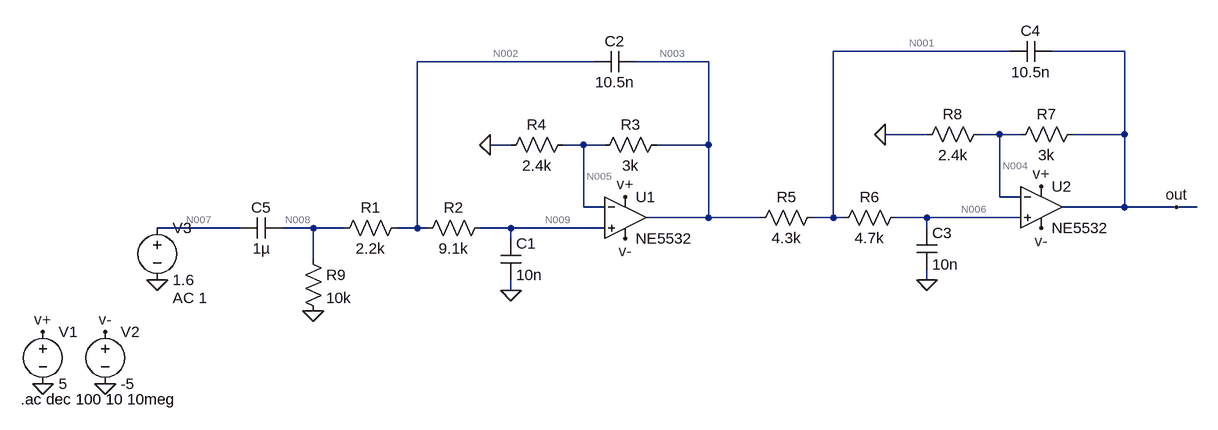
[diagram p0: schematic AF amp.asc]
AF amp.asc, the LTspice schematic file:
Version 4
SHEET 1 1012 680
WIRE 720 -128 448 -128
WIRE 896 -128 784 -128
WIRE 80 -112 -192 -112
WIRE 256 -112 144 -112
WIRE 592 0 528 0
WIRE 704 0 672 0
WIRE 736 0 704 0
WIRE 896 0 896 -128
WIRE 896 0 816 0
WIRE -48 16 -80 16
WIRE 64 16 32 16
WIRE 96 16 64 16
WIRE 256 16 256 -112
WIRE 256 16 176 16
WIRE 704 96 704 0
WIRE 736 96 704 96
WIRE 64 112 64 16
WIRE 96 112 64 112
WIRE 896 112 896 0
WIRE 896 112 800 112
WIRE 976 112 896 112
WIRE 1008 112 976 112
WIRE 256 128 256 16
WIRE 256 128 160 128
WIRE 336 128 256 128
WIRE 448 128 448 -128
WIRE 448 128 416 128
WIRE 464 128 448 128
WIRE 592 128 544 128
WIRE 736 128 592 128
WIRE -464 144 -592 144
WIRE -352 144 -400 144
WIRE -304 144 -352 144
WIRE -192 144 -192 -112
WIRE -192 144 -224 144
WIRE -176 144 -192 144
WIRE -48 144 -96 144
WIRE 96 144 -48 144
WIRE 592 144 592 128
WIRE -48 160 -48 144
WIRE -352 192 -352 144
WIRE 592 224 592 208
WIRE -48 240 -48 224
FLAG -768 304 v+
FLAG 128 96 v+
FLAG -672 304 v-
FLAG 128 160 v-
FLAG -672 384 0
FLAG -768 384 0
FLAG -592 224 0
FLAG -48 240 0
FLAG -80 16 0
FLAG 768 80 v+
FLAG 768 144 v-
FLAG 592 224 0
FLAG 976 112 out
FLAG -352 272 0
FLAG 528 0 0
DATAFLAG 256 -80 ""
DATAFLAG 896 -64 ""
DATAFLAG -384 144 ""
SYMBOL Opamps\\NE5532 128 64 R0
SYMATTR InstName U1
SYMBOL voltage -768 288 R0
WINDOW 123 0 0 Left 0
WINDOW 39 0 0 Left 0
SYMATTR InstName V1
SYMATTR Value 5
SYMBOL voltage -672 288 R0
WINDOW 123 0 0 Left 0
WINDOW 39 0 0 Left 0
SYMATTR InstName V2
SYMATTR Value -5
SYMBOL voltage -592 128 R0
WINDOW 123 24 124 Left 2
WINDOW 39 0 0 Left 0
SYMATTR InstName V3
SYMATTR Value 1.6
SYMATTR Value2 AC 1
SYMBOL res -208 128 R90
WINDOW 0 0 56 VBottom 2
WINDOW 3 32 56 VTop 2
SYMATTR InstName R1
SYMATTR Value 2.2k
SYMBOL res -80 128 R90
WINDOW 0 0 56 VBottom 2
WINDOW 3 32 56 VTop 2
SYMATTR InstName R2
SYMATTR Value 9.1k
SYMBOL cap -64 160 R0
SYMATTR InstName C1
SYMATTR Value 10n
SYMBOL cap 144 -128 R90
WINDOW 0 0 32 VBottom 2
WINDOW 3 32 32 VTop 2
SYMATTR InstName C2
SYMATTR Value 10.5n
SYMBOL res 192 0 R90
WINDOW 0 0 56 VBottom 2
WINDOW 3 32 56 VTop 2
SYMATTR InstName R3
SYMATTR Value 3k
SYMBOL res 48 0 R90
WINDOW 0 0 56 VBottom 2
WINDOW 3 32 56 VTop 2
SYMATTR InstName R4
SYMATTR Value 2.4k
SYMBOL Opamps\\NE5532 768 48 R0
SYMATTR InstName U2
SYMBOL res 432 112 R90
WINDOW 0 0 56 VBottom 2
WINDOW 3 32 56 VTop 2
SYMATTR InstName R5
SYMATTR Value 4.3k
SYMBOL res 560 112 R90
WINDOW 0 0 56 VBottom 2
WINDOW 3 32 56 VTop 2
SYMATTR InstName R6
SYMATTR Value 4.7k
SYMBOL cap 576 144 R0
SYMATTR InstName C3
SYMATTR Value 10n
SYMBOL cap 784 -144 R90
WINDOW 0 0 32 VBottom 2
WINDOW 3 32 32 VTop 2
SYMATTR InstName C4
SYMATTR Value 10.5n
SYMBOL res 832 -16 R90
WINDOW 0 0 56 VBottom 2
WINDOW 3 32 56 VTop 2
SYMATTR InstName R7
SYMATTR Value 3k
SYMBOL res 688 -16 R90
WINDOW 0 0 56 VBottom 2
WINDOW 3 32 56 VTop 2
SYMATTR InstName R8
SYMATTR Value 2.4k
SYMBOL cap -400 128 R90
WINDOW 0 0 32 VBottom 2
WINDOW 3 32 32 VTop 2
SYMATTR InstName C5
SYMATTR Value 1µ
SYMBOL res -368 176 R0
SYMATTR InstName R9
SYMATTR Value 10k
TEXT -802 408 Left 2 !.ac dec 100 10 10meg

The netlist it stands for:
* AF amp.asc
XU1 N009 N005 v+ v- N003 NE5532  ; pins In+ In- V+ V- OUT
V1 v+ 0 5
V2 v- 0 -5
V3 N007 0 1.6 AC 1
R1 N002 N008 2.2k
R2 N009 N002 9.1k
C1 N009 0 10n
C2 N003 N002 10.5n
R3 N003 N005 3k
R4 N005 0 2.4k
XU2 N006 N004 v+ v- out NE5532  ; pins In+ In- V+ V- OUT
R5 N001 N003 4.3k
R6 N006 N001 4.7k
C3 N006 0 10n
C4 out N001 10.5n
R7 out N004 3k
R8 N004 0 2.4k
C5 N008 N007 1µ
R9 N008 0 10k
.ac dec 100 10 10meg
.backanno
.end

* Results of the author's LTspice run, read from the files saved beside the schematic
* Operating Point, zero values left out:
*   V(n003) = -22.37 mV
*   V(v-) = -5 V
*   V(v+) = 5 V
*   V(n005) = -10.61 mV
*   V(n009) = -10.61 mV
*   V(n007) = 1.6 V
*   V(n002) = -6.079 mV
*   V(n008) = -4.983 mV
*   V(out) = -58.9 mV
*   V(n004) = -26.84 mV
*   V(n006) = -26.85 mV
*   V(n001) = -24.51 mV
*   I(R9) = -498.3 nA
*   I(R8) = -11.19 µA
*   I(R7) = -10.69 µA
*   I(R6) = -498.2 nA
*   I(R5) = -498.2 nA
*   I(R4) = -4.419 µA
*   I(R3) = -3.921 µA
*   I(R2) = -498.3 nA
*   I(R1) = -498.3 nA
*   I(V2) = 2.844 mA
*   I(V1) = -2.841 mA
*   Ix(u1:1) = 498.3 nA
*   Ix(u1:2) = 498.3 nA
*   Ix(u1:3) = 1.421 mA
*   Ix(u1:4) = -1.422 mA
*   Ix(u1:5) = 3.423 µA
*   Ix(u2:1) = 498.2 nA
*   Ix(u2:2) = 498.3 nA
*   Ix(u2:3) = 1.421 mA
*   Ix(u2:4) = -1.422 mA
*   Ix(u2:5) = 10.69 µA
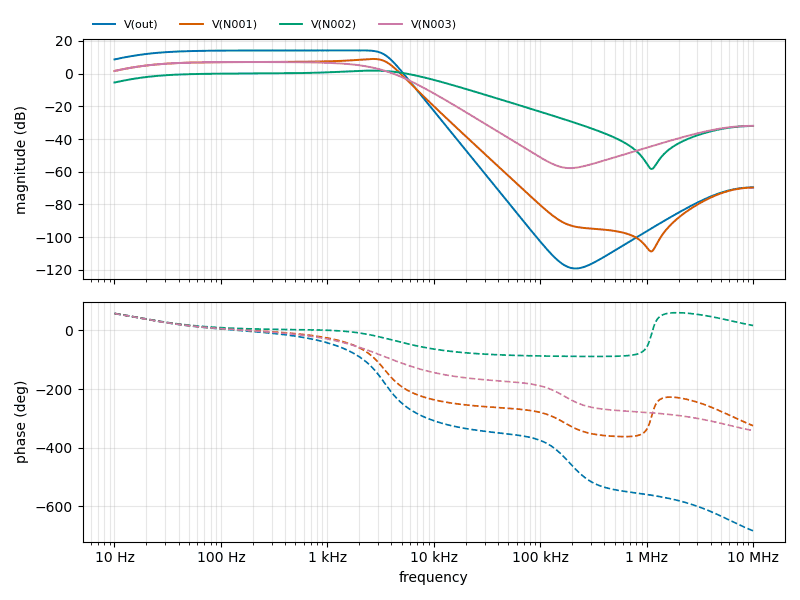
[diagram p1: AC Analysis of AF amp.asc, plotted from the saved traces]
* AC Analysis, 1 run:
*   V(out): 8.61 dB at 10 Hz, -69.54 dB at 10 MHz, peak 14.17 dB at 1.905 kHz, 3 dB below the peak at 16.18 Hz and 3.521 kHz
*   V(N001): 1.57 dB at 10 Hz, -69.61 dB at 10 MHz, peak 8.92 dB at 2.692 kHz, 3 dB below the peak at 28.81 Hz and 3.82 kHz
*   V(N002): -5.47 dB at 10 Hz, -32.01 dB at 10 MHz, peak 1.80 dB at 2.63 kHz, 3 dB below the peak at 27.78 Hz and 6.799 kHz
*   V(N003): 1.57 dB at 10 Hz, -31.94 dB at 10 MHz, peak 7.02 dB at 213.8 Hz, 3 dB below the peak at 15.79 Hz and 2.495 kHz